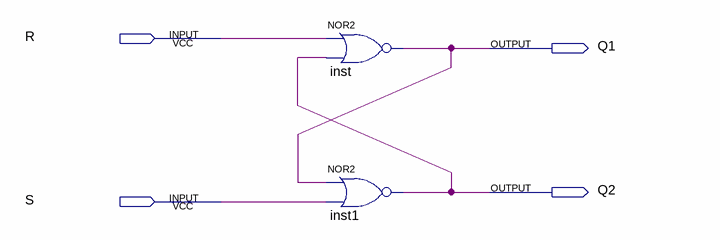
[diagram p0: schematic sheet]
// Quartus schematic latch_RS_nor.bdf as structural Verilog: 2 symbols, 4 pins
module latch_RS_nor (
  input  R,
  input  S,
  output Q1,
  output Q2
);

  nor inst (Q1, R, Q2);
  nor inst1 (Q2, Q1, S);
endmodule
